# Altium project Smart_Restaurant.PrjPcb
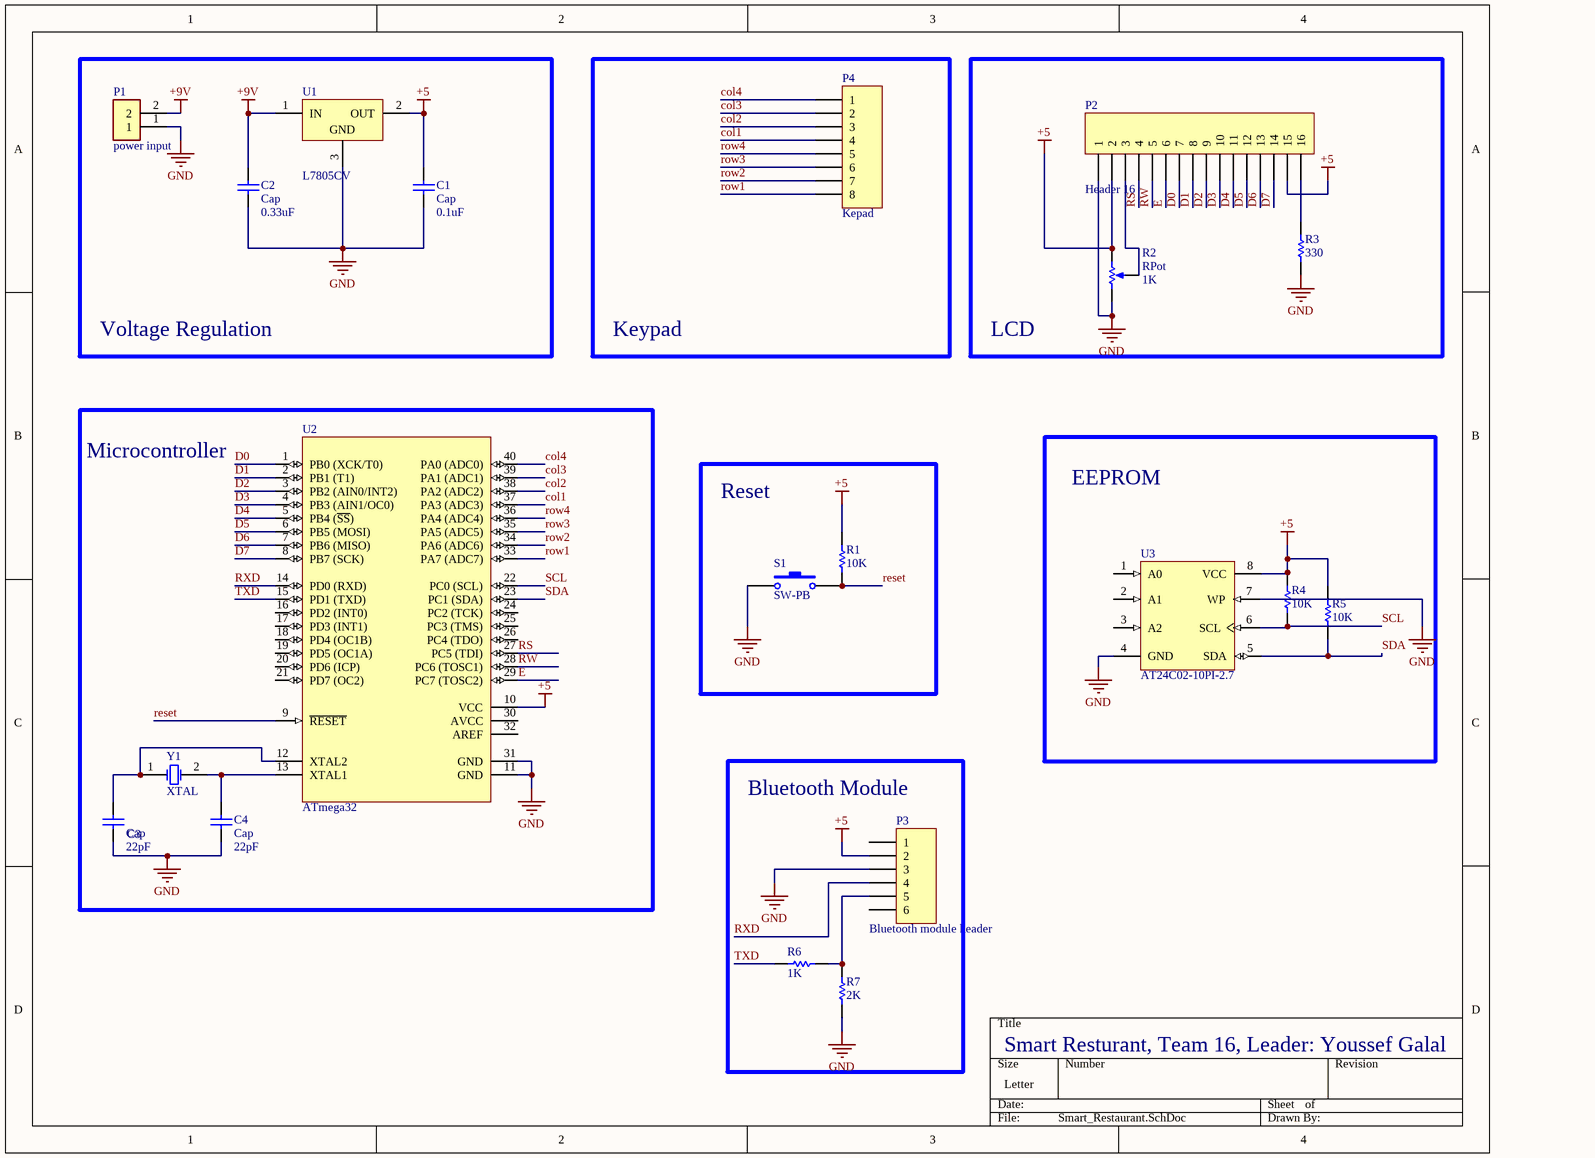
[diagram p0: Smart_Restaurant.SchDoc]
1 sheet, 20 parts. Net scope: global (net labels, ports and power ports of the same name join across sheets).
Board file: Smart_Restaurant.PcbDoc

## Sheet Smart_Restaurant.SchDoc
size Letter

### Parts
C1  Cap  value 0.1uF  [CAPACITOR]
C2  Cap  value 0.33uF  [CAPACITOR]
C3  Cap  value 22pF  [CAPACITOR]
C4  Cap  value 22pF  [CAPACITOR]
P1  power input  [TE_282837-2]
P2  Header 16  [HDR1X16]
P3  Bluetooth module header  [HDR1X6H]
P4  Kepad  [HDR1X8]
R1  10K  [RO3.2x1.7]
R2  RPot  value 1K  [VR5]
R3  330  [RO3.2x1.7]
R4  10K  [RO3.2x1.7]
R5  10K  [RO3.2x1.7]
R6  1K  [RO3.2x1.7]
R7  2K  [RO3.2x1.7]
S1  SW-PB  [SPST-2]
U1  L7805CV  [TO220ABN]
U2  ATmega32  [40P6]
U3  AT24C02-10PI-2.7  [8P3]
Y1  XTAL  [XTAL]

### Blocks framed on the sheet
Voltage Regulation: C1 C2 P1 U1
Keypad: P4
LCD: P2 R2 R3
Microcontroller: C3 C4 U2 Y1
Reset: R1 S1
EEPROM: R4 R5 U3
Bluetooth Module: P3 R6 R7

### Nets
+5: C1.2 P2.2 P2.15 P3.2 R1.2 R2.3(BOT) R4.2 R5.2 U1.2(OUT) U2.10(VCC) U3.8(VCC)
+9V: C2.2 P1.2 U1.1(IN)
GND: C1.1 C2.1 C3.1 C4.1 P1.1 P2.1 P3.3 R2.1(TOP) R3.1 R7.2 S1.1 U1.3(GND) U2.11(GND) U2.31(GND) U3.4(GND) U3.7(WP)
col1: P4.4 U2.37(PA3_(ADC3))
col2: P4.3 U2.38(PA2_(ADC2))
col3: P4.2 U2.39(PA1_(ADC1))
col4: P4.1 U2.40(PA0_(ADC0))
D0: P2.7 U2.1(PB0_(XCK/T0))
D1: P2.8 U2.2(PB1_(T1))
D2: P2.9 U2.3(PB2_(AIN0/INT2))
D3: P2.10 U2.4(PB3_(AIN1/OC0))
D4: P2.11 U2.5(PB4_(~{SS}))
D5: P2.12 U2.6(PB5_(MOSI))
D6: P2.13 U2.7(PB6_(MISO))
D7: P2.14 U2.8(PB7_(SCK))
E: P2.6 U2.29(PC7_(TOSC2))
reset: R1.1 S1.2 U2.9(~{RESET})
row1: P4.8 U2.33(PA7_(ADC7))
row2: P4.7 U2.34(PA6_(ADC6))
row3: P4.6 U2.35(PA5_(ADC5))
row4: P4.5 U2.36(PA4_(ADC4))
RS: P2.4 U2.27(PC5_(TDI))
RW: P2.5 U2.28(PC6_(TOSC1))
RXD: P3.4 U2.14(PD0_(RXD))
SCL: R4.1 U2.22(PC0_(SCL)) U3.6(SCL)
SDA: R5.1 U2.23(PC1_(SDA)) U3.5(SDA)
TXD: R6.2 U2.15(PD1_(TXD))
NetC3_2: C3.2 U2.12(XTAL2) Y1.1(OSC1)
NetC4_2: C4.2 U2.13(XTAL1) Y1.2(OSC2)
NetP2_3: P2.3 R2.2(TAP)
NetP2_16: P2.16 R3.2
NetP3_5: P3.5 R6.1 R7.1

Not connected (* = marked no-connect by the designer): P3 1 6; U2 16(PD2_(INT0)) 17(PD3_(INT1)) 18(PD4_(OC1B)) 19(PD5_(OC1A)) 20(PD6_(ICP)) 21(PD7_(OC2)) 24(PC2_(TCK)) 25(PC3_(TMS)) 26(PC4_(TDO)) 30(AVCC) 32(AREF); U3 1(A0) 2(A1) 3(A2)

### Notes on the sheet
- Smart Resturant, Team 16, Leader: Youssef Galal

### Library data of the parts
C1-C4 = Cap: Capacitor; Published: 8-Jun-2000; LatestRevisionDate: 17-Jul-2002; LatestRevisionNote: Re-released for DXP Platform.; PackageReference: RAD-0.3; Publisher: Altium Limited
P1 = 282837-2: Connector Terminal Blocks Receptacle 2 Position 5.08mm Solder Straight Thru-Hole 13.5A/Contact; MF: TE Connectivity; Price: None; Check_prices: https://www.snapeda.com/parts/282837-2/TE%20Connectivity%20AMP%20Connectors/view-part/2549980/?ref=eda; Package: None; Purchase-URL: https://pricing.snapeda.com/search/part/282837-2/?ref=eda; SnapEDA_Link: https://www.snapeda.com/parts/282837-2/TE%20Connectivity%20AMP%20Connectors/view-part/2549980/?ref=snap; Value: *; MP: 282837-2; Availability: Good
P2 = Header 16: Header, 16-Pin; LatestRevisionDate: 17-Jul-2002; LatestRevisionNote: Re-released for DXP Platform.; Publisher: Altium Limited
P3 = Header 6H: Header, 6-Pin, Right Angle; LatestRevisionDate: 17-Jul-2002; LatestRevisionNote: Re-released for DXP Platform.; Publisher: Altium Limited
P4 = Header 8: Header, 8-Pin; LatestRevisionDate: 17-Jul-2002; LatestRevisionNote: Re-released for DXP Platform.; Publisher: Altium Limited
R1 R3-R7 = EROS2C: Metal Film Resistor, 2 Ohm to 1M Ohm Range, 0.5% and 1% Tolerance, 0.25 W; Published: 17-Dec-2003; PackageReference: RO3.2x1.7; Publisher: Altium Limited; ComponentLink1Description: Manufacturer Link; ComponentLink1URL: http://www.panasonic.com/industrial/components/resistive_products.htm; ComponentLink2Description: Datasheet; ComponentLink2URL: http://www.panasonic.com/industrial/components/pdf/AOA0000CE14.pdf; ComponentLink3Description: Discontinuation Notice; ComponentLink3URL: http://www.panasonic.com/industrial/components/pdf/dc050.pdf
R2 = RPot: Potentiometer; Sim Note: Enter the Resistance value and the set point into parameter fields.; Set Position: 0.5; Published: 8-Jun-2000; LatestRevisionDate: 17-Jul-2002; LatestRevisionNote: Re-released for DXP Platform.; PackageReference: VR5; Publisher: Altium Limited
S1 = SW-PB: Switch; Published: 24-Mar-1999; LatestRevisionDate: 17-Jul-2002; LatestRevisionNote: Re-released for DXP Platform.; PackageReference: SPST-2; Publisher: Altium Limited
U1 = L7805CV: Positive Voltage Regulator; Note: Tab is connected to pin 3 (GND).; Published: 24-Aug-2001; LatestRevisionDate: 17-Jul-2002; LatestRevisionNote: Re-released for DXP Platform.; DatasheetVersion: Dec-1998; PackageVersion: Jun-1998; PackageReference: TO220ABN; Publisher: Altium Limited; PackageDescription: TO, Thru-Hole, Vertical, Heatsink Mounted; 3 In-Line Leads; Pitch 2.54 mm; Pin sequence 1, 3, 2; ComponentLink1Description: Manufacturer Link; ComponentLink1URL: http://www.st.com/
U2 = ATmega16L-8PI: 8-Bit AVR Microcontroller with 16K Bytes of In-System Programmable Flash Memory; Published: 17-Sep-2003; DatasheetVersion: 2466E-AVR-10/02; PackageVersion: revB, Sep-2001; PackageReference: 40P6; Publisher: Altium Limited; PackageDescription: 40-lead (0.600"/15.24mm Wide) Plastic Dual Inline Package (PDIP); Supplier 1: Digi-Key; Supplier Part Number 1: ATMEGA16L-8PI-ND; Supplier 2: Mouser; Supplier Part Number 2: 556-ATMEGA16L-8PI; Code_JEDEC: MS-011-AC; ComponentLink1Description: Datasheet; ComponentLink1URL: http://www.atmel.com/dyn/resources/prod_documents/doc2466.pdf; ComponentLink2Description: Atmel.com Home; ComponentLink2URL: http://www.atmel.com
U3 = AT24C02-10PI-2.7: 2-WIre Serial EEPROM-2K-Dip-Industerial -Vcc=2.7to5.5V; Manufacturer: Atmel; PART NO: AT24C02-10PI-2.7
Y1 = XTAL: Crystal Oscillator; Published: 8-Jun-2000; LatestRevisionDate: 17-Jul-2002; LatestRevisionNote: Re-released for DXP Platform.; PackageReference: R38; Publisher: Altium Limited; PackageDescription: Crystal, Thru-Hole; 2 Leads; Body 3.1 x 8.2 mm (Dia.xH)